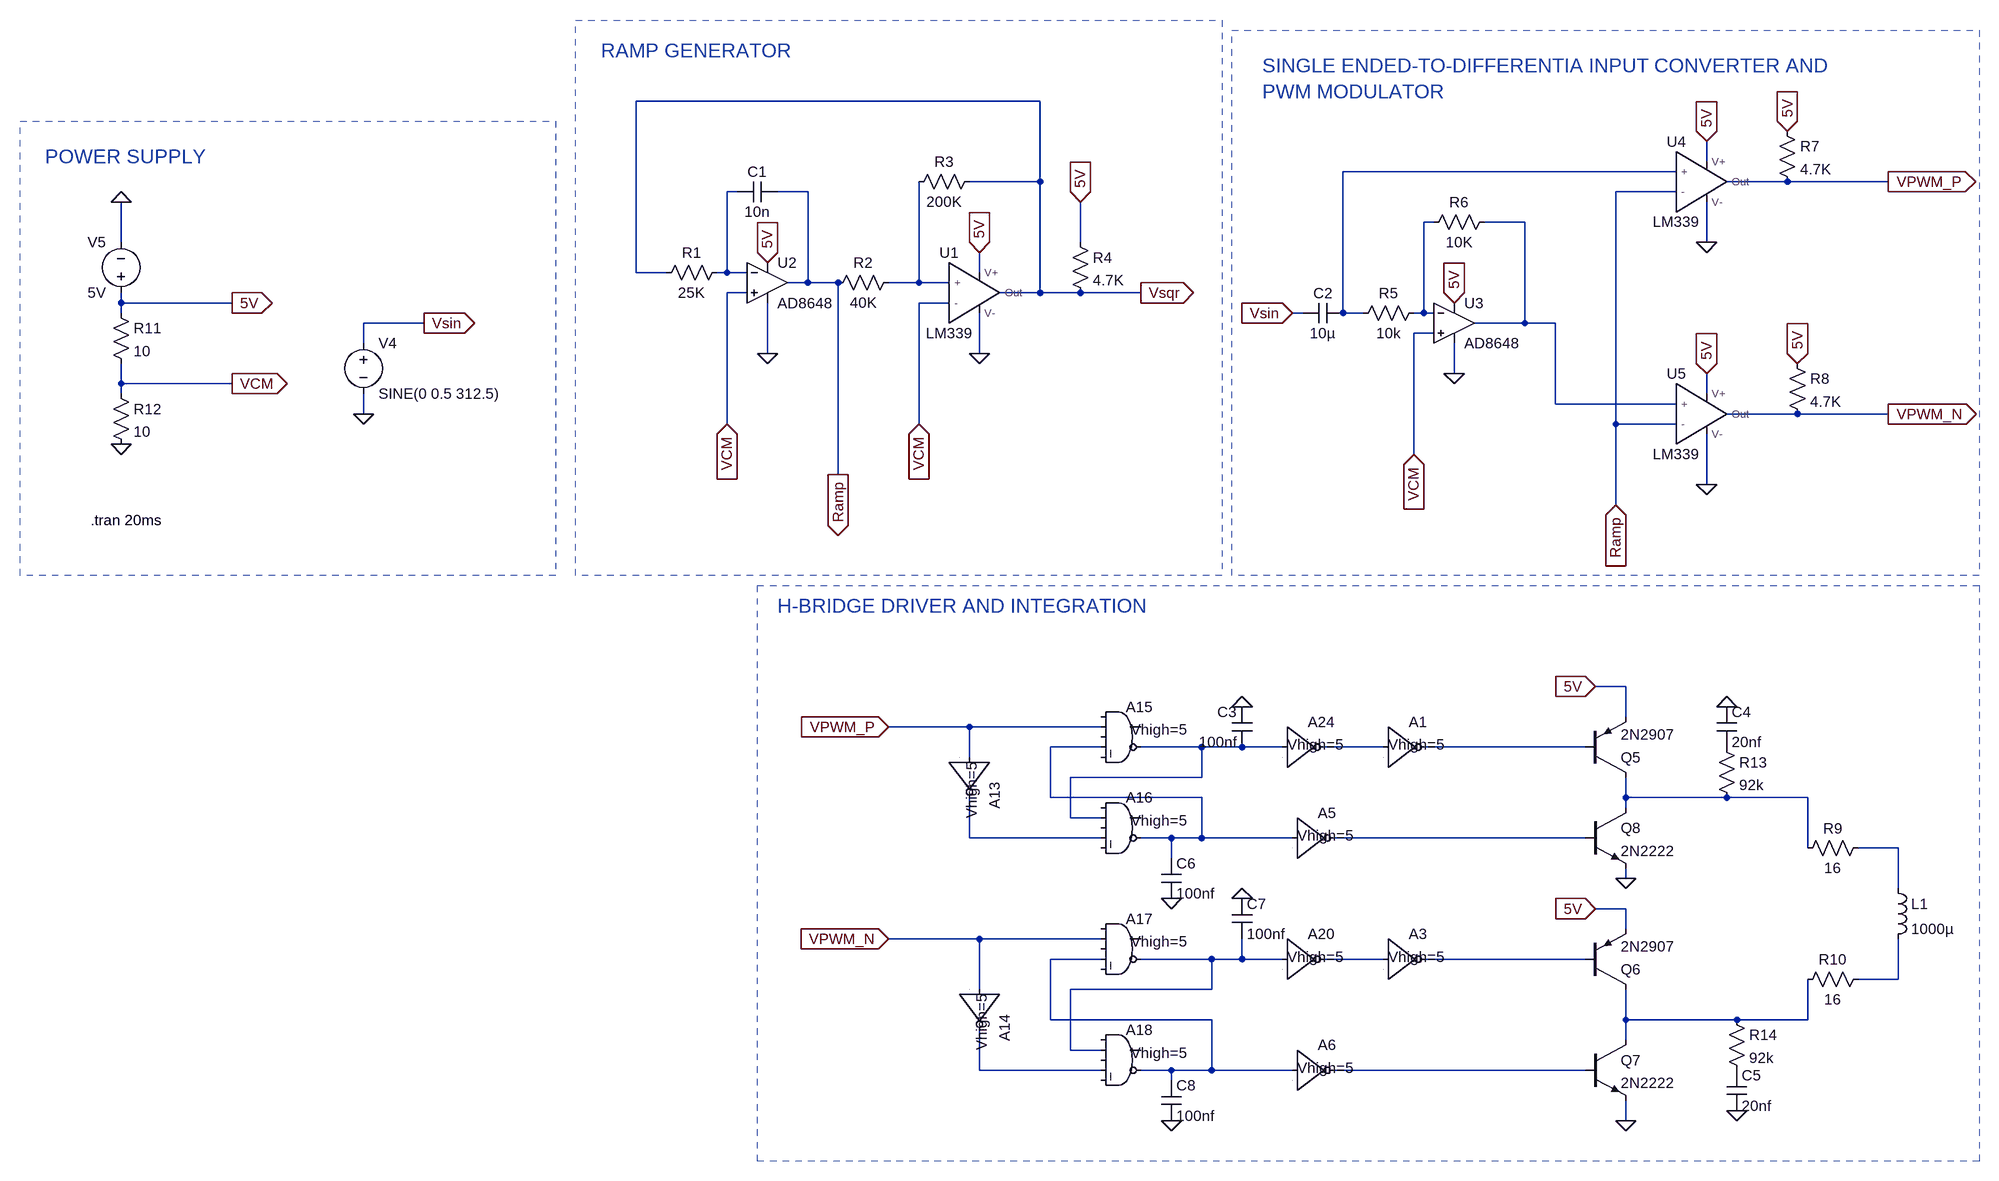
[diagram p0: schematic Analog3.asc]
Analog3.asc, the LTspice schematic file:
Version 4
SHEET 1 2888 724
WIRE 752 -960 112 -960
WIRE 1808 -864 1808 -896
WIRE 1760 -848 1232 -848
WIRE 752 -832 752 -960
WIRE 752 -832 640 -832
WIRE 1936 -832 1840 -832
WIRE 2096 -832 1936 -832
WIRE 272 -816 256 -816
WIRE 384 -816 336 -816
WIRE 1760 -816 1664 -816
WIRE 1376 -768 1360 -768
WIRE 1520 -768 1456 -768
WIRE -704 -736 -704 -800
WIRE 816 -736 816 -800
WIRE 1808 -736 1808 -800
WIRE 112 -688 112 -960
WIRE 160 -688 112 -688
WIRE 256 -688 256 -816
WIRE 256 -688 240 -688
WIRE 288 -688 256 -688
WIRE 656 -688 656 -720
WIRE 384 -672 384 -816
WIRE 384 -672 352 -672
WIRE 432 -672 384 -672
WIRE 560 -672 560 -832
WIRE 560 -672 512 -672
WIRE 608 -672 560 -672
WIRE 288 -656 256 -656
WIRE 752 -656 752 -832
WIRE 752 -656 688 -656
WIRE 816 -656 752 -656
WIRE 912 -656 816 -656
WIRE -704 -640 -704 -656
WIRE -528 -640 -704 -640
WIRE 608 -640 560 -640
WIRE -704 -624 -704 -640
WIRE 1168 -624 1152 -624
WIRE 1232 -624 1232 -848
WIRE 1264 -624 1232 -624
WIRE 1360 -624 1360 -768
WIRE 1360 -624 1344 -624
WIRE 1376 -624 1360 -624
WIRE -224 -608 -320 -608
WIRE 1520 -608 1520 -768
WIRE 1520 -608 1440 -608
WIRE 1568 -608 1520 -608
WIRE 1376 -592 1344 -592
WIRE -320 -576 -320 -608
WIRE 320 -560 320 -640
WIRE 656 -560 656 -624
WIRE 1408 -528 1408 -576
WIRE -704 -512 -704 -544
WIRE -528 -512 -704 -512
WIRE -704 -496 -704 -512
WIRE 1808 -496 1808 -528
WIRE 1568 -480 1568 -608
WIRE 1760 -480 1568 -480
WIRE -320 -464 -320 -496
WIRE 1952 -464 1840 -464
WIRE 2096 -464 1952 -464
WIRE 256 -448 256 -656
WIRE 560 -448 560 -640
WIRE 1664 -448 1664 -816
WIRE 1760 -448 1664 -448
WIRE 1344 -400 1344 -592
WIRE 432 -368 432 -672
WIRE 1808 -352 1808 -432
WIRE 1664 -320 1664 -448
WIRE 1680 -32 1632 -32
WIRE 1680 16 1680 -32
WIRE 640 32 512 32
WIRE 848 32 640 32
WIRE 848 64 768 64
WIRE 1008 64 912 64
WIRE 1072 64 1008 64
WIRE 1136 64 1072 64
WIRE 1296 64 1200 64
WIRE 1616 64 1360 64
WIRE 640 80 640 32
WIRE 1008 112 1008 64
WIRE 1008 112 800 112
WIRE 768 144 768 64
WIRE 1008 144 768 144
WIRE 1680 144 1680 112
WIRE 1840 144 1680 144
WIRE 1968 144 1840 144
WIRE 1680 160 1680 144
WIRE 800 176 800 112
WIRE 848 176 800 176
WIRE 640 208 640 144
WIRE 848 208 640 208
WIRE 960 208 912 208
WIRE 1008 208 1008 144
WIRE 1008 208 960 208
WIRE 1152 208 1008 208
WIRE 1616 208 1216 208
WIRE 1968 224 1968 144
WIRE 2112 224 2048 224
WIRE 960 240 960 208
WIRE 1680 272 1680 256
WIRE 2112 288 2112 224
WIRE 1680 320 1632 320
WIRE 1680 352 1680 320
WIRE 656 368 512 368
WIRE 848 368 656 368
WIRE 848 400 768 400
WIRE 1024 400 912 400
WIRE 1072 400 1072 368
WIRE 1072 400 1024 400
WIRE 1136 400 1072 400
WIRE 1296 400 1200 400
WIRE 1616 400 1360 400
WIRE 2112 432 2112 368
WIRE 2112 432 2048 432
WIRE 656 448 656 368
WIRE 1024 448 1024 400
WIRE 1024 448 800 448
WIRE 768 496 768 400
WIRE 1024 496 768 496
WIRE 1680 496 1680 448
WIRE 1856 496 1680 496
WIRE 1968 496 1968 432
WIRE 1968 496 1856 496
WIRE 1680 528 1680 496
WIRE 800 544 800 448
WIRE 848 544 800 544
WIRE 656 576 656 512
WIRE 848 576 656 576
WIRE 960 576 912 576
WIRE 1024 576 1024 496
WIRE 1024 576 960 576
WIRE 1152 576 1024 576
WIRE 1616 576 1216 576
WIRE 960 592 960 576
WIRE 1680 656 1680 624
FLAG 1680 656 0
FLAG 1680 272 0
FLAG 960 656 0
FLAG 1072 304 0
FLAG 960 304 0
FLAG 320 -560 0
FLAG 656 -560 0
FLAG -320 -464 0
FLAG 1808 -736 0
FLAG 1408 -528 0
FLAG 2096 -832 VPWM_P
IOPIN 2096 -832 Out
FLAG 2096 -464 VPWM_N
IOPIN 2096 -464 Out
FLAG -704 -416 0
FLAG -704 -800 0
FLAG -528 -640 5V
IOPIN -528 -640 Out
FLAG 432 -368 Ramp
IOPIN 432 -368 Out
FLAG 1664 -320 Ramp
IOPIN 1664 -320 In
FLAG 912 -656 Vsqr
IOPIN 912 -656 Out
FLAG -528 -512 VCM
IOPIN -528 -512 Out
FLAG 256 -448 VCM
IOPIN 256 -448 In
FLAG 1344 -400 VCM
IOPIN 1344 -400 In
FLAG 560 -448 VCM
IOPIN 560 -448 In
FLAG -224 -608 Vsin
IOPIN -224 -608 Out
FLAG 1152 -624 Vsin
IOPIN 1152 -624 In
FLAG 320 -704 5V
IOPIN 320 -704 In
FLAG 816 -800 5V
IOPIN 816 -800 In
FLAG 1408 -640 5V
IOPIN 1408 -640 In
FLAG 1808 -528 5V
IOPIN 1808 -528 In
FLAG 1952 -544 5V
IOPIN 1952 -544 In
FLAG 1936 -912 5V
IOPIN 1936 -912 In
FLAG 1808 -896 5V
IOPIN 1808 -896 In
FLAG 656 -720 5V
IOPIN 656 -720 In
FLAG 1808 -352 0
FLAG 1632 -32 5V
IOPIN 1632 -32 In
FLAG 1632 320 5V
IOPIN 1632 320 In
FLAG 512 32 VPWM_P
IOPIN 512 32 In
FLAG 512 368 VPWM_N
IOPIN 512 368 In
FLAG 1072 0 0
FLAG 1856 640 0
FLAG 1840 0 0
DATAFLAG 560 -560 ""
DATAFLAG -576 -640 ""
DATAFLAG 1344 -464 ""
DATAFLAG 1664 -336 ""
DATAFLAG 432 -464 ""
SYMBOL Digital\\inv 704 80 R90
WINDOW 39 8 60 Left 2
SYMATTR SpiceLine Vhigh=5
SYMATTR InstName A13
SYMBOL Digital\\inv 720 448 R90
WINDOW 39 8 60 Left 2
SYMATTR SpiceLine Vhigh=5
SYMATTR InstName A14
SYMBOL Digital\\and 880 -16 R0
WINDOW 40 16 52 Left 2
SYMATTR SpiceLine2 Vhigh=5
SYMATTR InstName A15
SYMBOL Digital\\and 880 128 R0
WINDOW 39 16 52 Left 2
SYMATTR SpiceLine Vhigh=5
SYMATTR InstName A16
SYMBOL Digital\\and 880 320 R0
WINDOW 39 16 52 Left 2
SYMATTR SpiceLine Vhigh=5
SYMATTR InstName A17
SYMBOL Digital\\and 880 496 R0
WINDOW 39 16 52 Left 2
SYMATTR SpiceLine Vhigh=5
SYMATTR InstName A18
SYMBOL pnp 1616 112 M180
SYMATTR InstName Q5
SYMATTR Value 2N2907
SYMBOL pnp 1616 448 M180
SYMATTR InstName Q6
SYMATTR Value 2N2907
SYMBOL npn 1616 528 R0
SYMATTR InstName Q7
SYMATTR Value 2N2222
SYMBOL npn 1616 160 R0
SYMATTR InstName Q8
SYMATTR Value 2N2222
SYMBOL res 2064 208 R90
WINDOW 0 0 56 VBottom 2
WINDOW 3 32 56 VTop 2
SYMATTR InstName R9
SYMATTR Value 16
SYMBOL res 2064 416 R90
WINDOW 0 0 56 VBottom 2
WINDOW 3 32 56 VTop 2
SYMATTR InstName R10
SYMATTR Value 16
SYMBOL Digital\\inv 1136 336 R0
WINDOW 39 8 60 Left 2
SYMATTR SpiceLine Vhigh=5
SYMATTR InstName A20
SYMBOL cap 944 240 R0
SYMATTR InstName C6
SYMATTR Value 100nf
SYMBOL cap 1056 304 R0
SYMATTR InstName C7
SYMATTR Value 100nf
SYMBOL cap 944 592 R0
SYMATTR InstName C8
SYMATTR Value 100nf
SYMBOL Digital\\inv 1136 0 R0
WINDOW 39 8 60 Left 2
SYMATTR SpiceLine Vhigh=5
SYMATTR InstName A24
SYMBOL LM339.New 640 -656 R0
SYMATTR InstName U1
SYMBOL OpAmps\\AD8648 320 -736 R0
SYMATTR InstName U2
SYMBOL res 800 -752 R0
SYMATTR InstName R4
SYMATTR Value 4.7K
SYMBOL res 656 -848 R90
WINDOW 0 0 56 VBottom 2
WINDOW 3 32 56 VTop 2
SYMATTR InstName R3
SYMATTR Value 200K
SYMBOL res 528 -688 R90
WINDOW 0 0 56 VBottom 2
WINDOW 3 32 56 VTop 2
SYMATTR InstName R2
SYMATTR Value 40K
SYMBOL res 256 -704 R90
WINDOW 0 0 56 VBottom 2
WINDOW 3 32 56 VTop 2
SYMATTR InstName R1
SYMATTR Value 25K
SYMBOL cap 336 -832 R90
WINDOW 0 0 32 VBottom 2
WINDOW 3 32 32 VTop 2
SYMATTR InstName C1
SYMATTR Value 10n
SYMBOL voltage -320 -592 R0
WINDOW 123 0 0 Left 0
WINDOW 39 0 0 Left 0
SYMATTR InstName V4
SYMATTR Value SINE(0 0.5 312.5)
SYMBOL OpAmps\\AD8648 1408 -672 R0
SYMATTR InstName U3
SYMBOL LM339.New 1792 -832 R0
SYMATTR InstName U4
SYMBOL LM339.New 1792 -464 R0
SYMATTR InstName U5
SYMBOL res 1936 -560 R0
SYMATTR InstName R8
SYMATTR Value 4.7K
SYMBOL res 1920 -928 R0
SYMATTR InstName R7
SYMATTR Value 4.7K
SYMBOL res 1472 -784 R90
WINDOW 0 0 56 VBottom 2
WINDOW 3 32 56 VTop 2
SYMATTR InstName R6
SYMATTR Value 10K
SYMBOL res 1360 -640 R90
WINDOW 0 0 56 VBottom 2
WINDOW 3 32 56 VTop 2
SYMATTR InstName R5
SYMATTR Value 10k
SYMBOL cap 1232 -640 R90
WINDOW 0 0 32 VBottom 2
WINDOW 3 32 32 VTop 2
SYMATTR InstName C2
SYMATTR Value 10µ
SYMBOL voltage -704 -640 R180
WINDOW 0 24 96 Left 2
WINDOW 3 24 16 Left 2
WINDOW 123 0 0 Left 0
WINDOW 39 0 0 Left 0
SYMATTR InstName V5
SYMATTR Value 5V
SYMBOL res -720 -640 R0
SYMATTR InstName R11
SYMATTR Value 10
SYMBOL res -720 -512 R0
SYMATTR InstName R12
SYMATTR Value 10
SYMBOL Digital\\inv 1296 0 R0
WINDOW 39 8 60 Left 2
SYMATTR SpiceLine Vhigh=5
SYMATTR InstName A1
SYMBOL Digital\\inv 1296 336 R0
WINDOW 39 8 60 Left 2
SYMATTR SpiceLine Vhigh=5
SYMATTR InstName A3
SYMBOL cap 1088 64 R180
WINDOW 0 24 56 Left 2
WINDOW 3 24 8 Left 2
SYMATTR InstName C3
SYMATTR Value 100nf
SYMBOL Digital\\inv 1152 144 R0
WINDOW 39 8 60 Left 2
SYMATTR SpiceLine Vhigh=5
SYMATTR InstName A5
SYMBOL Digital\\inv 1152 512 R0
WINDOW 39 8 60 Left 2
SYMATTR SpiceLine Vhigh=5
SYMATTR InstName A6
SYMBOL res 1824 48 R0
SYMATTR InstName R13
SYMATTR Value 92k
SYMBOL res 1840 480 R0
SYMATTR InstName R14
SYMATTR Value 92k
SYMBOL cap 1824 0 R0
SYMATTR InstName C4
SYMATTR Value 20nf
SYMBOL cap 1840 576 R0
SYMATTR InstName C5
SYMATTR Value 20nf
SYMBOL ind 2096 272 R0
SYMATTR InstName L1
SYMATTR Value 1000µ
TEXT -752 -296 Left 2 !.tran 20ms
TEXT -824 -872 Left 3 ;POWER SUPPLY
TEXT 1104 -1016 Left 3 ;SINGLE ENDED-TO-DIFFERENTIA INPUT CONVERTER AND \nPWM MODULATOR
TEXT 56 -1040 Left 3 ;RAMP GENERATOR
TEXT 336 -160 Left 3 ;H-BRIDGE DRIVER AND INTEGRATION
RECTANGLE Normal 1040 -208 16 -1088 2
RECTANGLE Normal -16 -208 -864 -928 2
RECTANGLE Normal 2240 720 304 -192 2
RECTANGLE Normal 2240 -208 1056 -1072 2

The netlist it stands for:
* Analog3.asc
A13 VPWM_P 0 0 0 0 N011 0 0 BUF Vhigh=5
A14 VPWM_N 0 0 0 0 N020 0 0 BUF Vhigh=5
A15 0 VPWM_P 0 N006 0 N007 0 0 AND Vhigh=5
A16 0 N007 0 N011 0 N006 0 0 AND Vhigh=5
A17 0 VPWM_N 0 N014 0 N015 0 0 AND Vhigh=5
A18 0 N015 0 N020 0 N014 0 0 AND Vhigh=5
Q5 N010 N009 5V 0 2N2907
Q6 N019 N017 5V 0 2N2907
Q7 N019 N021 0 0 2N2222
Q8 N010 N012 0 0 2N2222
R9 N013 N010 16
R10 N018 N019 16
A20 N015 0 0 0 0 N016 0 0 BUF Vhigh=5
C6 N006 0 100nf
C7 0 N015 100nf
C8 N014 0 100nf
A24 N007 0 0 0 0 N008 0 0 BUF Vhigh=5
XU1 N005 VCM 5V 0 Vsqr LM339  ; pins + - V+ V- Out
XU2 VCM N002 5V 0 Ramp AD8648  ; pins In+ In- V+ V- OUT
R4 5V Vsqr 4.7K
R3 Vsqr N005 200K
R2 N005 Ramp 40K
R1 N002 Vsqr 25K
C1 Ramp N002 10n
V4 Vsin 0 SINE(0 0.5 312.5)
XU3 VCM N003 5V 0 N004 AD8648  ; pins In+ In- V+ V- OUT
XU4 N001 Ramp 5V 0 VPWM_P LM339  ; pins + - V+ V- Out
XU5 N004 Ramp 5V 0 VPWM_N LM339  ; pins + - V+ V- Out
R8 5V VPWM_N 4.7K
R7 5V VPWM_P 4.7K
R6 N004 N003 10K
R5 N003 N001 10k
C2 N001 Vsin 10µ
V5 5V 0 5V
R11 5V VCM 10
R12 VCM 0 10
A1 N008 0 0 0 0 N009 0 0 BUF Vhigh=5
A3 N016 0 0 0 0 N017 0 0 BUF Vhigh=5
C3 N007 0 100nf
A5 N006 0 0 0 0 N012 0 0 BUF Vhigh=5
A6 N014 0 0 0 0 N021 0 0 BUF Vhigh=5
R13 P001 N010 92k
R14 N019 P002 92k
C4 0 P001 20nf
C5 P002 0 20nf
L1 N013 N018 1000µ
.model NPN NPN
.model PNP PNP
.lib standard.bjt
.tran 20ms
* POWER SUPPLY
* SINGLE ENDED-TO-DIFFERENTIA INPUT CONVERTER AND
* PWM MODULATOR
* RAMP GENERATOR
* H-BRIDGE DRIVER AND INTEGRATION
.lib A:\Electronic LAB\LM339.new.sub
.lib ADI.lib
.backanno
.end